# EAGLE design IMU 6DoF (EAGLE 6.2)
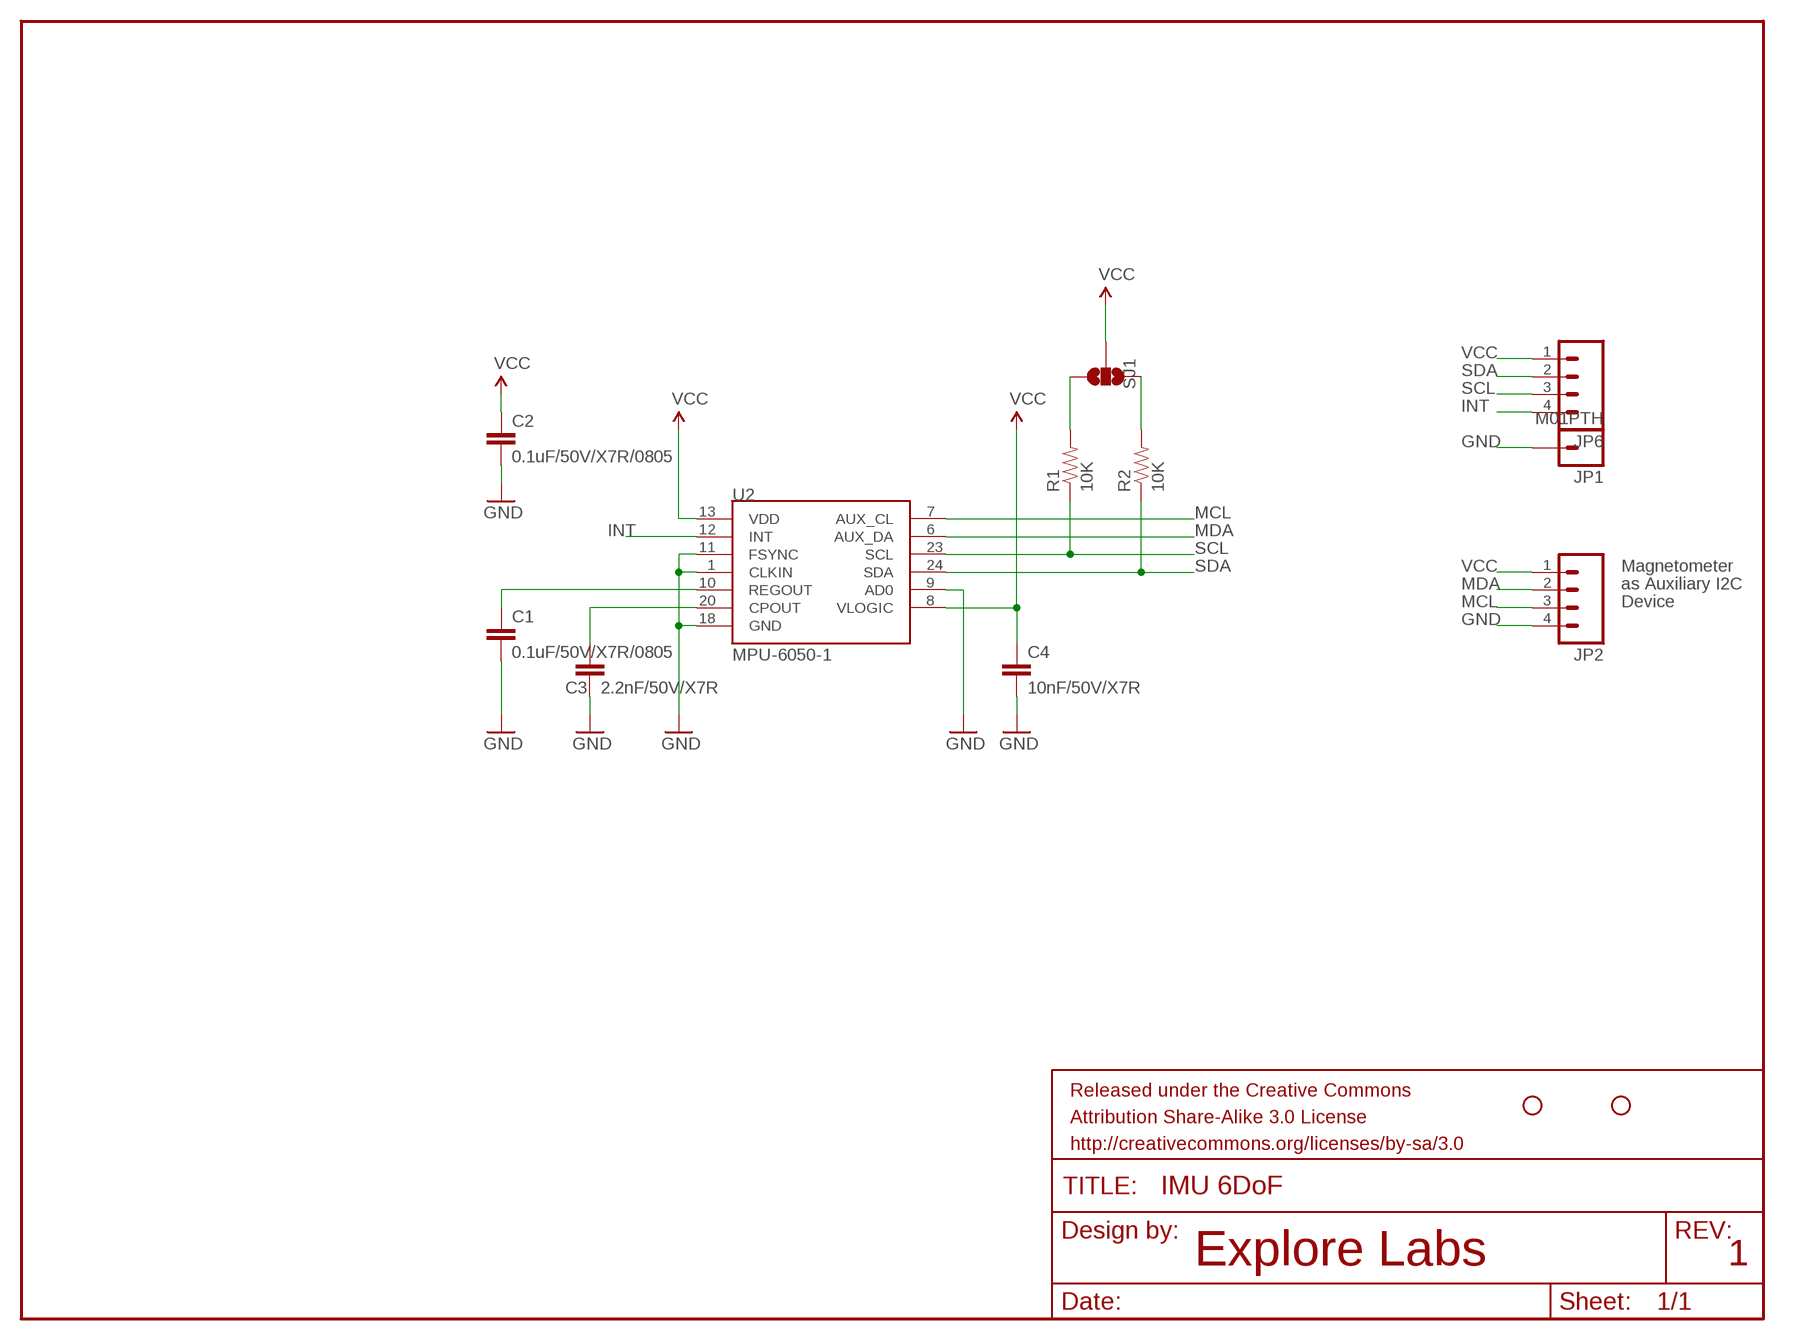
[diagram p0: schematic, sheet 1]

## Parts
C1  0.1uF/50V/X7R/0805  CAP0805  [0805]
C2  0.1uF/50V/X7R/0805  CAP0805  [0805]
C3  2.2nF/50V/X7R  CAP0805  [0805]
C4  10nF/50V/X7R  CAP0805  [0805]
JP1  M01PTH  [1X01]
JP2  M04PTH  [1X04]
JP3  STAND-OFFTIGHT  [STAND-OFF-TIGHT]
JP4  STAND-OFFTIGHT  [STAND-OFF-TIGHT]
JP6  M04PTH  [1X04]
R1  10K  RESISTOR0603-RES  [0603-RES]
R2  10K  RESISTOR0603-RES  [0603-RES]
SJ1  SOLDERJUMPER_2WAYT  [SJ_2]
U2  MPU-6050-1  [QFN-24-4MM2]

## Nets
GND: C1.2 C2.2 C3.2 C4.2 JP1.1 JP2.4 U2.1(CLKIN) U2.9(AD0) U2.11(FSYNC) U2.18(GND)
INT: JP6.4 U2.12(INT)
MCL: JP2.3 U2.7(AUX_CL)
MDA: JP2.2 U2.6(AUX_DA)
N$1: C3.1 U2.20(CPOUT)
N$2: C1.1 U2.10(REGOUT)
N$3: R1.2 SJ1.3
N$4: R2.2 SJ1.1
SCL: JP6.3 R1.1 U2.23(SCL)
SDA: JP6.2 R2.1 U2.24(SDA)
VCC: C2.1 C4.1 JP2.1 JP6.1 SJ1.2 U2.8(VLOGIC) U2.13(VDD)

## Notes on the sheet
- Magnetometer
- as Auxiliary I2C
- Device
- Explore Labs | 1

## Library data of the parts
C1-C4 = SparkFun-Passives:CAP: Capacitor Standard 0603 ceramic capacitor, and 0.1" leaded capacitor.
JP1 = SparkFun-Connectors:M01: Header 1 Standard 1-pin 0.1" header. Use with straight break away headers (SKU : PRT-00116), right angle break away headers (PRT-00553), swiss pins (PRT-00743), machine pins (PRT-00117), and female headers (PRT-00115).
JP2 JP6 = SparkFun-Connectors:M04: Header 4 Standard 4-pin 0.1" header. Use with straight break away headers (SKU : PRT-00116), right angle break away headers (PRT-00553), swiss pins (PRT-00743), machine pins (PRT-00117), and female headers (PRT-00115). Molex polarized connector foot print use with SKU : PRT-08231 with associated crimp pins and housings. 1MM SMD Version SKU: PRT-10208
JP3 JP4 = SparkFun-Electromechanical:STAND-OFF: #4 Stand Off This is the mechanical footprint for a #4 phillips button head screw. Use the keepout ring to avoid running the screw head into surrounding components. SKU : PRT-00447
R1 R2 = SparkFun-Passives:RESISTOR: Resistor Basic schematic elements and footprints for 0603, 1206, and PTH resistors.
SJ1 = SparkFun-Passives:SOLDERJUMPER_2WAY: Solder Jumper 2 way solder jumper
U2 = Testing:MPU-6050

## Net classes
0 Default: width 0.203 mm
1 vcc: width 0.254 mm
2 GND: width 0.813 mm

## Board
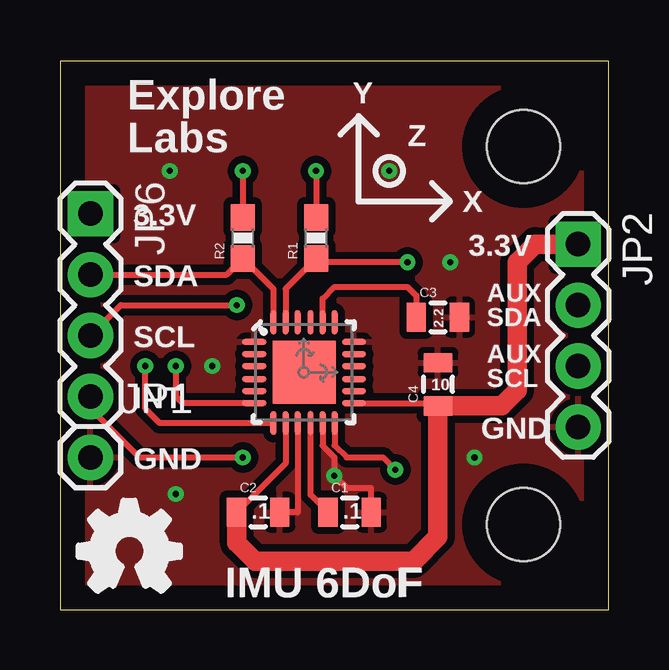
[diagram p1: board, top side]
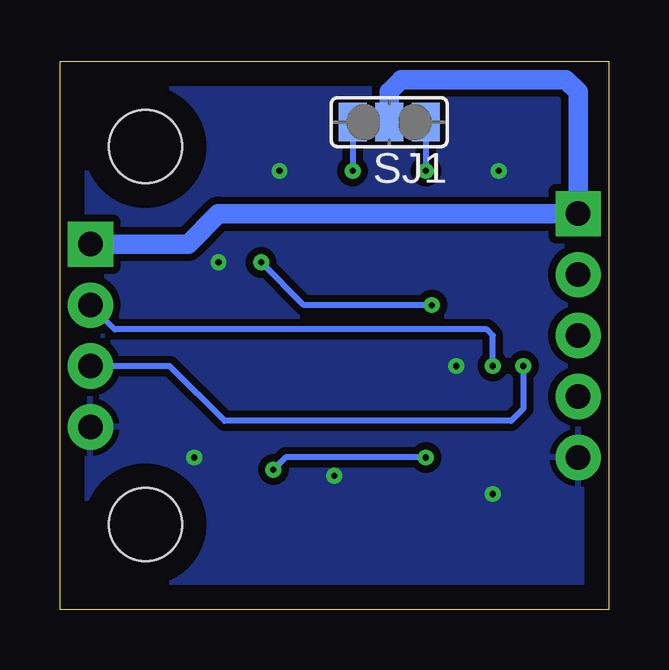
[diagram p2: board, bottom side, seen from below]

Size 22.86 x 22.86 mm. Coordinates in mm from the lower left corner, seen from the top.
Outline: 0,0 22.86,0 22.86,22.86 0,22.86 0,0
Copper layers (1*16): Top 0.035mm / dielectric 1.5mm / Bottom 0.035mm
Design rules: minimum track width 10mil, minimum drill 24mil, track to track 8mil, track to pad 8mil, pad to pad 8mil, via to via 8mil, smd to smd 8mil, copper to edge 40mil, drill to drill 8mil, minimum pad ring 10mil, minimum via ring 8mil, stop-mask expansion 4mil, vias tented up to drill 0mil, thermal gap 10mil
tRestrict: area 9.9,12.7 to 10.9,13.7; area 8.9,8.6 to 11.4,11.2; area 4.1,8.4 to 4.6,9.7; area 20.6,20.3 to 21.8,21.8; area 20.3,1 to 21.8,2.5
bRestrict: area 20.6,20.3 to 21.8,21.8; area 20.3,1 to 21.8,2.5

### Footprints (pad centres in the part's own frame; a part is rotated, then mirrored left to right if it is on the bottom)
0805 = smd 0.8 x 1.2: 1 -0.9,0; 2 0.9,0
1X01 = drill 1.016 pad 1.88: 1 0,0
1X04 = drill 1.016 pad 1.88 square: 1 0,0 | drill 1.016 pad 1.88: 2 2.54,0; 3 5.08,0; 4 7.62,0
STAND-OFF-TIGHT = hole 3.048: 0,0
0603-RES = smd 1.1 x 1: 1 -0.85,0; 2 0.85,0
SJ_2 = smd 1.168 x 1.6: 1 -1.524,0; 2 0,0; 3 1.524,0
QFN-24-4MM2 = smd 1.016 x 0.254: 1 -2.066,1.257; 2 -2.066,0.75; 3 -2.066,0.247; 4 -2.066,-0.287; 5 -2.066,-0.792; 6 -2.066,-1.297; 13 2.086,-1.297; 14 2.086,-0.792; 15 2.086,-0.287; 16 2.086,0.247; 17 2.086,0.75; 18 2.086,1.257 | smd 0.254 x 1.016: 7 -1.267,-2.122; 8 -0.762,-2.122; 9 -0.258,-2.122; 10 0.278,-2.122; 11 0.78,-2.122; 12 1.287,-2.122; 19 1.287,2.082; 20 0.78,2.082; 21 0.278,2.082; 22 -0.258,2.082; 23 -0.762,2.082; 24 -1.267,2.082 | smd 2.616 x 2.616: P$1 0.02,-0.01

### Placement (x,y rotation side)
C1  12.07,4.06 0 top
C2  8.26,4.06 0 top
C3  15.75,12.19 0 top
C4  15.75,9.4 90 top
JP1  1.27,6.35 0 top
JP2  21.59,15.24 270 top
JP3  19.3,19.3 0 top
JP4  19.3,3.56 0 top
JP6  1.27,16.51 270 top
LOGO1  OSHW_LOGO_FILLX0150-NT  [OSHW_FILLX150_NOTEXT]  0.76,0.76 0 top
R1  10.67,15.49 90 top
R2  7.62,15.49 90 top
SJ1  9.14,20.32 180 bottom
U2  10.16,9.91 0 top

### Tracks (layer width: path | path; a pad name or v marks a point on that pad's centre or on a via)
GND  (via drill 0.25)
  Top 0.254: U2.9 9.9,4.06 C2.2 | U2.11 10.94,6.84 11.43,6.35 v11.43,5.59 11.94,5.08 12.95,5.08 12.95,4.08 C1.2
  other vias: 16.26,14.48 4.83,4.83 17.27,6.35 6.35,10.16 4.57,18.29 13.72,18.29
  pour Top (isolate 0.305): 0,22.86 22.86,22.86 22.86,0 0,0
  pour Bottom (isolate 0.305): 0,22.86 22.86,22.86 22.86,0 0,0
INT  (via drill 0.25)
  Top 0.254: v7.62,6.35 3.3,6.35 1.52,8.13 1.27,8.13 JP6.4 | U2.12 11.45,6.84 11.94,6.35 13.46,6.35 v13.97,5.84
  Bottom 0.254: v7.62,6.35 13.46,6.35 v13.97,5.84
MCL  (via drill 0.25)
  Top 0.254: U2.7 4.15,7.78 3.56,8.38 v3.56,10.16
  Bottom 0.254: JP2.3 18.29,10.16 16,7.87 4.06,7.87 3.56,8.38 v3.56,10.16
MDA  (via drill 0.25)
  Top 0.254: v4.83,10.16 4.83,8.89 5.11,8.61 U2.6
  Bottom 0.254: v4.83,10.16 4.83,11.43 5.08,11.68 20.57,11.68 JP2.2
N$1
  Top 0.254: U2.20 10.94,12.97 11.43,13.46 14.48,13.46 14.85,13.09 C3.1
N$2
  Top 0.254: C1.1 10.44,4.79 U2.10
N$3  (via drill 0.25)
  Top 0.254: v10.67,18.29 R1.2
  Bottom 0.254: SJ1.3 v10.67,18.29
N$4  (via drill 0.25)
  Top 0.254: v7.62,18.29 R2.2
  Bottom 0.254: SJ1.1 v7.62,18.29
SCL  (via drill 0.25)
  Top 0.254: U2.23 9.4,13.37 R1.1 10.83,14.48 v14.48,14.48 | v7.37,12.7 2.54,12.7 JP6.3
  Bottom 0.254: v7.37,12.7 12.7,12.7 v14.48,14.48
SDA
  Top 0.254: U2.24 8.89,13.37 R2.1 7.16,14.18 6.95,13.97 JP6.2
VCC
  Top 0.254: U2.8 9.4,6.1 C2.1 | U2.13 15.64,8.61 C4.1
  Top 0.813: JP2.1 19.81,15.24 19.05,14.48 19.05,9.14 18.4,8.5 C4.1 15.75,3.05 14.73,2.03 8.13,2.03 7.37,2.79 C2.1
  Bottom 0.813: SJ1.2 9.14,21.59 8.64,22.1 1.78,22.1 1.27,21.59 JP6.1 16.26,16.51 17.53,15.24 JP2.1

### Text on the board
tPlace: IMU 6DoF
_tsilk: Explore | Y | Labs | Z | X | 3.3V | 3.3V | SDA | AUX | 2.2 | SDA | SCL | 10 | AUX | SCL | INT | GND | GND | .1 | .1 | IMU 6DoF
_bsilk: Pull-Ups | 3.3V | 3.3V | SDA | AUX | SDA | SCL | AUX | SCL | INT | GND | GND | Made in India